# EAGLE design adapter_board (EAGLE 9.6.2)

## Sheet 1 of 2: Connectors
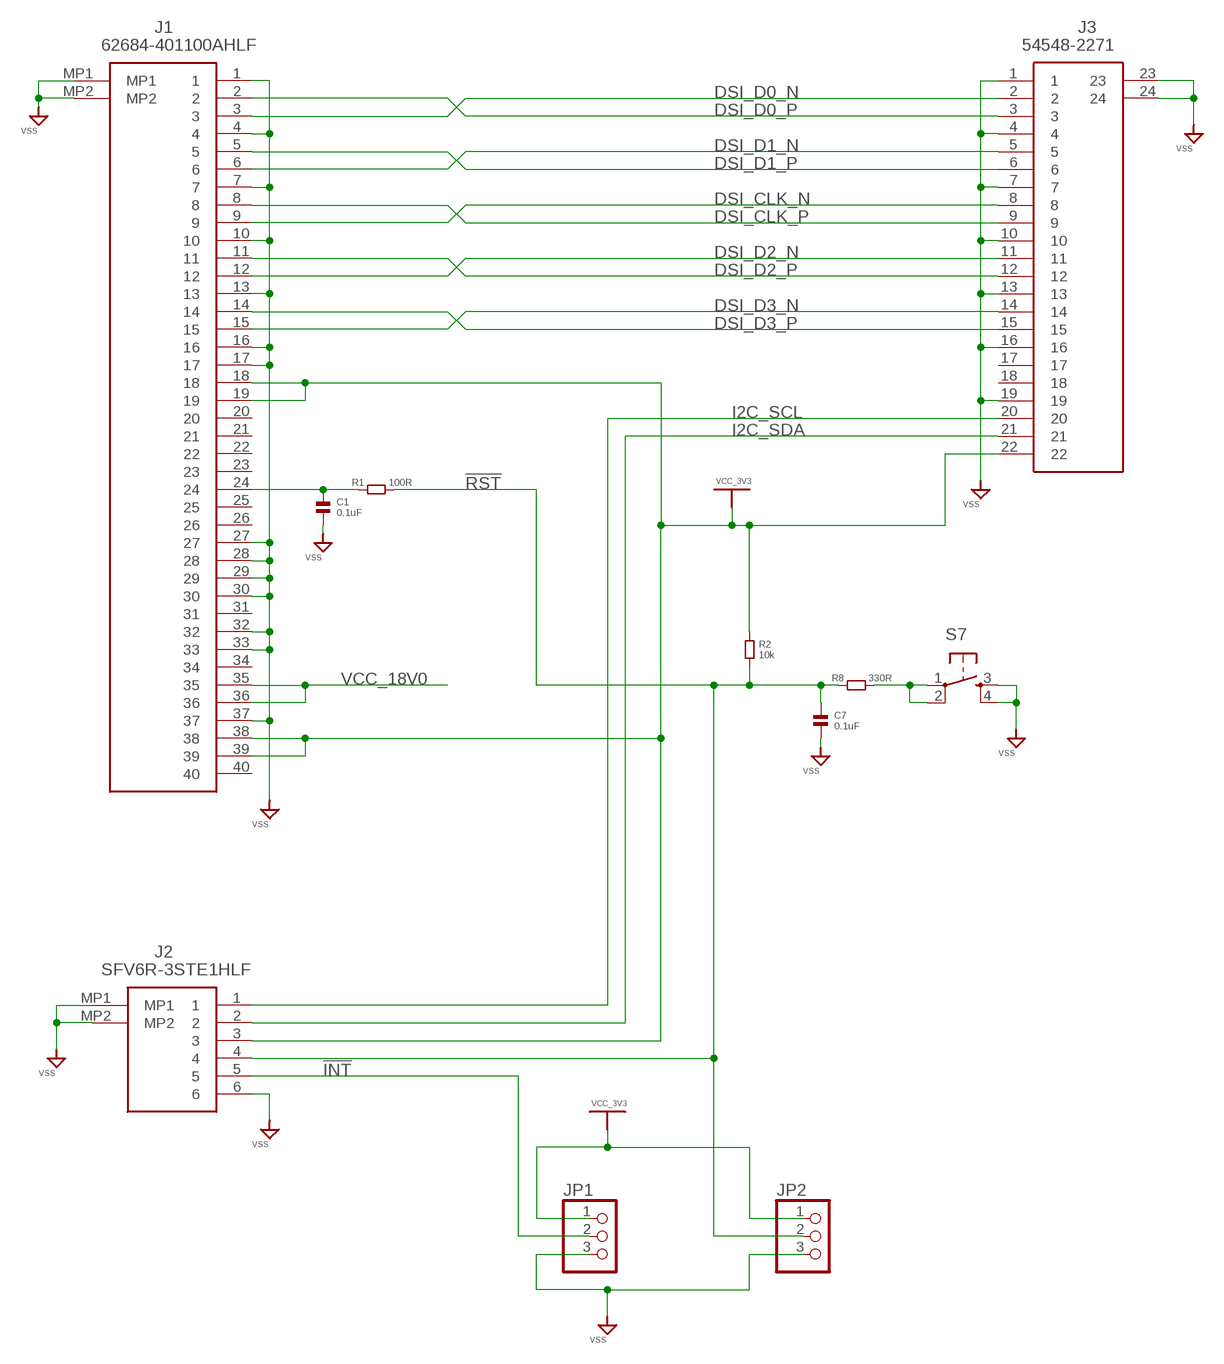
[diagram p0: schematic, sheet 1]

### Parts
C1  0.1uF  CAPACITOR.0603  [0603]
C7  0.1uF  CAPACITOR.0603  [0603]
J1  62684-401100AHLF  [62684401100AHLF]
J2  SFV6R-3STE1HLF  [SFV6R3STE1HLF]
J3  54548-2271  [545482271]
JP1  PINHD-1X3  [1X03]
JP2  PINHD-1X3  [1X03]
R1  100R  RESISTOR.0603  [0603]
R2  10k  RESISTOR.0603  [0603]
R8  330R  RESISTOR.0603  [0603]
S7  TAC_SWITCHPTH  [TACTILE-PTH]

### Nets
!INT: J2.5 JP1.2
!RST: C7.1 J2.4 JP2.2 R1.2 R2.2 R8.1
DSI_CLK_N [DSI]: J1.9 J3.8
DSI_CLK_P [DSI]: J1.8 J3.9
DSI_D0_N [DSI]: J1.3 J3.2
DSI_D0_P [DSI]: J1.2 J3.3
DSI_D1_N [DSI]: J1.6 J3.5
DSI_D1_P [DSI]: J1.5 J3.6
DSI_D2_N [DSI]: J1.12 J3.11
DSI_D2_P [DSI]: J1.11 J3.12
DSI_D3_N [DSI]: J1.15 J3.14
DSI_D3_P [DSI]: J1.14 J3.15
I2C_SCL: J2.1 J3.20
I2C_SDA: J2.2 J3.21
N$1: C1.1 J1.24 R1.1
N$5: R8.2 S7.1 S7.2
VCC_3V3: J1.18 J1.19 J1.38 J1.39 J2.3 J3.22 JP1.1 JP2.1 R2.1
VCC_18V0: J1.35 J1.36 ; also sheet 2
VSS: C1.2 C7.2 J1.1 J1.4 J1.7 J1.10 J1.13 J1.16 J1.17 J1.27 J1.28 J1.29 J1.30 J1.32 J1.33 J1.37 J1.MP1 J1.MP2 J2.6 J2.MP1 J2.MP2 J3.1 J3.4 J3.7 J3.10 J3.13 J3.16 J3.19 J3.23 J3.24 JP1.3 JP2.3 S7.3 S7.4 ; also sheet 2
Unconnected: J1.20 J1.21 J1.22 J1.23 J1.25 J1.26 J1.31 J1.34 J1.40 J3.17 J3.18

## Sheet 2 of 2: Backlight Boost Converter
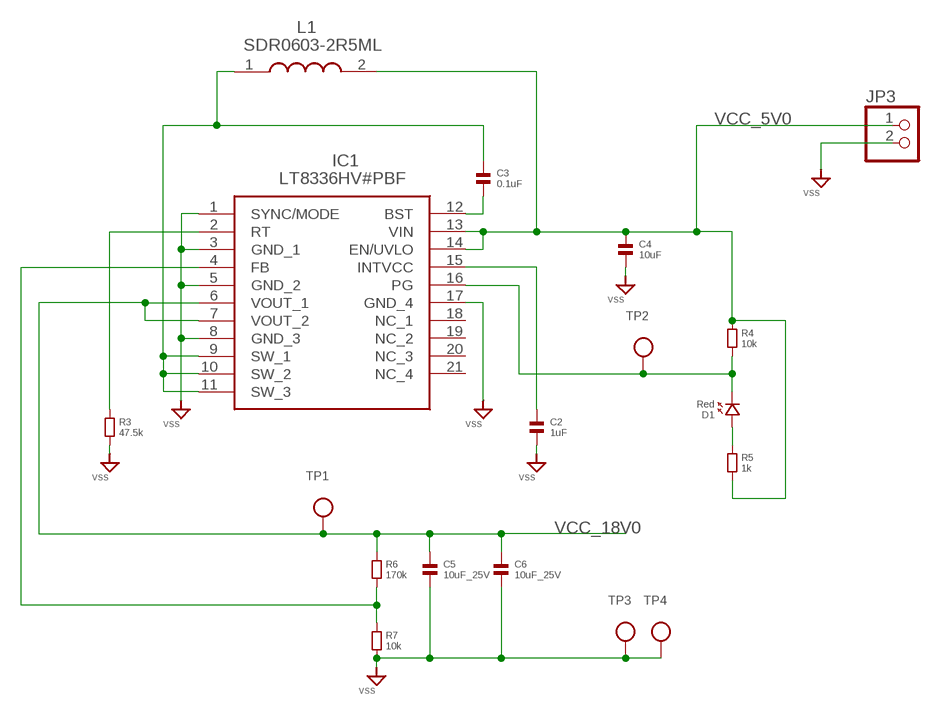
[diagram p1: schematic, sheet 2]

### Parts
C2  1uF  CAPACITOR.0603  [0603]
C3  0.1uF  CAPACITOR.0603  [0603]
C4  10uF  CAPACITOR.0603  [0603]
C5  10uF_25V  CAPACITOR.0805  [0805]
C6  10uF_25V  CAPACITOR.0805  [0805]
D1  Red  LED.0603  [0603.LED]
IC1  LT8336HV#PBF  [LT8336HVPBF]
JP3  PINHD-1X2  [1X02]
L1  SDR0603-2R5ML  [SDR06032R5ML]
R3  47.5k  RESISTOR.0603  [0603]
R4  10k  RESISTOR.0603  [0603]
R5  1k  RESISTOR.0603  [0603]
R6  170k  RESISTOR.0603  [0603]
R7  10k  RESISTOR.0603  [0603]
TP1  TESTPOINTROUND1MM  [TESTPOINT_ROUND_1MM]
TP2  TESTPOINTROUND1MM  [TESTPOINT_ROUND_1MM]
TP3  TESTPOINTROUND1MM  [TESTPOINT_ROUND_1MM]
TP4  TESTPOINTROUND1MM  [TESTPOINT_ROUND_1MM]

### Nets
N$2: C2.1 IC1.15(INTVCC)
N$3: IC1.2(RT) R3.1
N$4: C3.1 IC1.9(SW_1) IC1.10(SW_2) IC1.11(SW_3) L1.1
N$7: C3.2 IC1.12(BST)
N$8: D1.P$2 IC1.16(PG) R4.2 TP2.P$1
N$9: D1.P$1 R5.1
N$12: IC1.4(FB) R6.2 R7.1
VCC_5V0: C4.1 IC1.13(VIN) IC1.14(EN/UVLO) JP3.1 L1.2 R4.1 R5.2
VCC_18V0: C5.1 C6.1 IC1.6(VOUT_1) IC1.7(VOUT_2) R6.1 TP1.P$1 ; also sheet 1
VSS: C2.2 C4.2 C5.2 C6.2 IC1.1(SYNC/MODE) IC1.3(GND_1) IC1.5(GND_2) IC1.8(GND_3) IC1.17(GND_4) JP3.2 R3.2 R7.2 TP3.P$1 TP4.P$1 ; also sheet 1
Unconnected: IC1.18(NC_1) IC1.19(NC_2) IC1.20(NC_3) IC1.21(NC_4)

## Library data of the parts
C1-C7 = standardparts:CAPACITOR
D1 = standardparts:LED
IC1 = SamacSys_Parts:LT8336HV#PBF: Switching Voltage Regulators 40V, 2.5A Low IQ Sync Step-Up Silent Sw Source: Datasheet <https://www.arrow.com/en/products/lt8336hvpbf/analog-devices>; DESCRIPTION: Switching Voltage Regulators 40V, 2.5A Low IQ Sync Step-Up Silent Sw; HEIGHT: 1.03mm; MANUFACTURER_NAME: Analog Devices; MANUFACTURER_PART_NUMBER: LT8336HV#PBF; MOUSER_PART_NUMBER: 584-LT8336HV#PBF; MOUSER_PRICE-STOCK: https://www.mouser.co.uk/ProductDetail/Analog-Devices/LT8336HVPBF?qs=bAKSY%2FctAC6ZfL1l2LeQJQ%3D%3D
J1 = SamacSys_Parts:62684-401100AHLF: FFC & FPC Connectors 62684-401100AHLF-OPUD Source: Datasheet <https://www.mouser.co.uk/datasheet/2/18/62684-1363141.pdf>; DESCRIPTION: FFC & FPC Connectors 62684-401100AHLF-OPUD; HEIGHT: 2.3mm; MANUFACTURER_NAME: Amphenol; MANUFACTURER_PART_NUMBER: 62684-401100AHLF; MOUSER_PART_NUMBER: 649-62684-401100AHLF; MOUSER_PRICE-STOCK: https://www.mouser.co.uk/ProductDetail/Amphenol-FCI/62684-401100AHLF?qs=6gcroF09reXdRG%252BmgzzG%2FQ%3D%3D
J2 = SamacSys_Parts:SFV6R-3STE1HLF: FFC & FPC Connectors 6P R/A SMT FFC/FPC 0.5mm CONT SPACING Source: Datasheet; DESCRIPTION: FFC & FPC Connectors 6P R/A SMT FFC/FPC 0.5mm CONT SPACING; HEIGHT: 2mm; MANUFACTURER_NAME: Amphenol; MANUFACTURER_PART_NUMBER: SFV6R-3STE1HLF; MOUSER_PART_NUMBER: 649-SFV6R-3STE1HLF; MOUSER_PRICE-STOCK: https://www.mouser.co.uk/ProductDetail/Amphenol-FCI/SFV6R-3STE1HLF?qs=pLQRQR43dtql2xROP1LV5w%3D%3D
J3 = SamacSys_Parts:54548-2271: FFC & FPC Connectors 0.5 FPC ZIF Hsg Assy ssy 22Ckt EmbsTp Pkg Source: Datasheet <http://www.molex.com/webdocs/datasheets/pdf/en-us//0545482271_FFC_FPC_CONNECTORS.pdf>; DESCRIPTION: FFC & FPC Connectors 0.5 FPC ZIF Hsg Assy ssy 22Ckt EmbsTp Pkg; HEIGHT: 1mm; MANUFACTURER_NAME: Molex; MANUFACTURER_PART_NUMBER: 54548-2271; MOUSER_PART_NUMBER: 538-54548-2271; MOUSER_PRICE-STOCK: https://www.mouser.co.uk/ProductDetail/Molex/54548-2271?qs=qM7ngqbhX5X3ZiWzRWv9wA%3D%3D
JP1 JP2 = pinhead:PINHD-1X3: PIN HEADER
JP3 = pinhead:PINHD-1X2: PIN HEADER
L1 = SamacSys_Parts:SDR0603-2R5ML: Fixed Inductors 2.5uH 20% SMD 0603 Source: Datasheet <https://datasheet.datasheetarchive.com/originals/distributors/Datasheets-7/DSA-121824.pdf>; DESCRIPTION: Fixed Inductors 2.5uH 20% SMD 0603; HEIGHT: 3.9mm; MANUFACTURER_NAME: Bourns; MANUFACTURER_PART_NUMBER: SDR0603-2R5ML; MOUSER_PART_NUMBER: 652-SDR0603-2R5ML; MOUSER_PRICE-STOCK: https://www.mouser.co.uk/ProductDetail/Bourns/SDR0603-2R5ML?qs=xrpI9KL%2FXvtC70ZWV5ML9w%3D%3D
R1-R8 = standardparts:RESISTOR
S7 = SparkFun:TAC_SWITCH: Momentary Switch Button commonly used for reset or general input. Spark Fun Electronics SKU : COM-00097
TP1-TP4 = microbuilder:TESTPOINT: Test Point Various test points for characterisation and PCB testing TESTPOINT_SMT - Compact Surface Mount Test Point [Digikey: 5016KTR-ND]

## Net classes
1 DSI: width 0.127 mm, clearance 0.152 mm

## Board
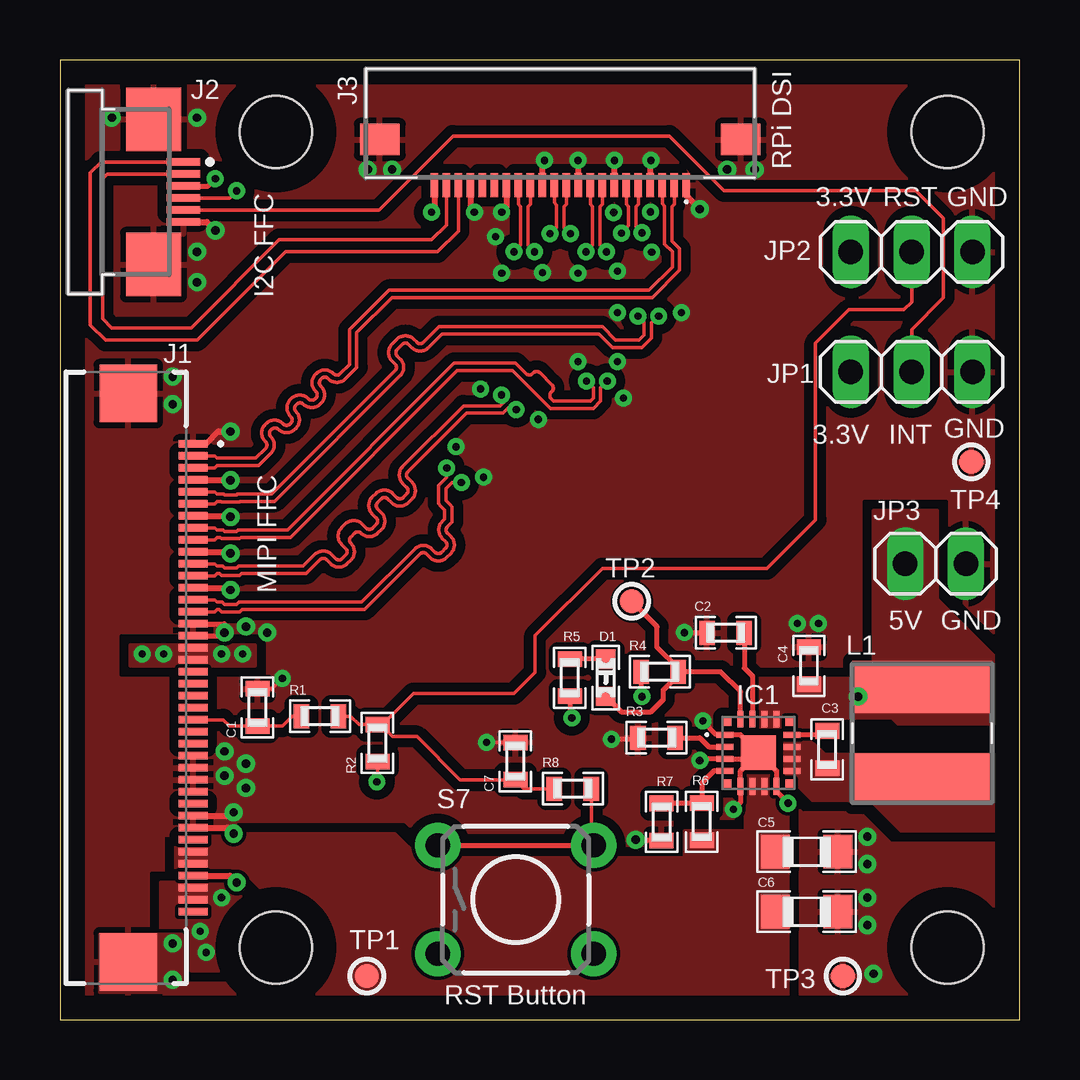
[diagram p2: board, top side]
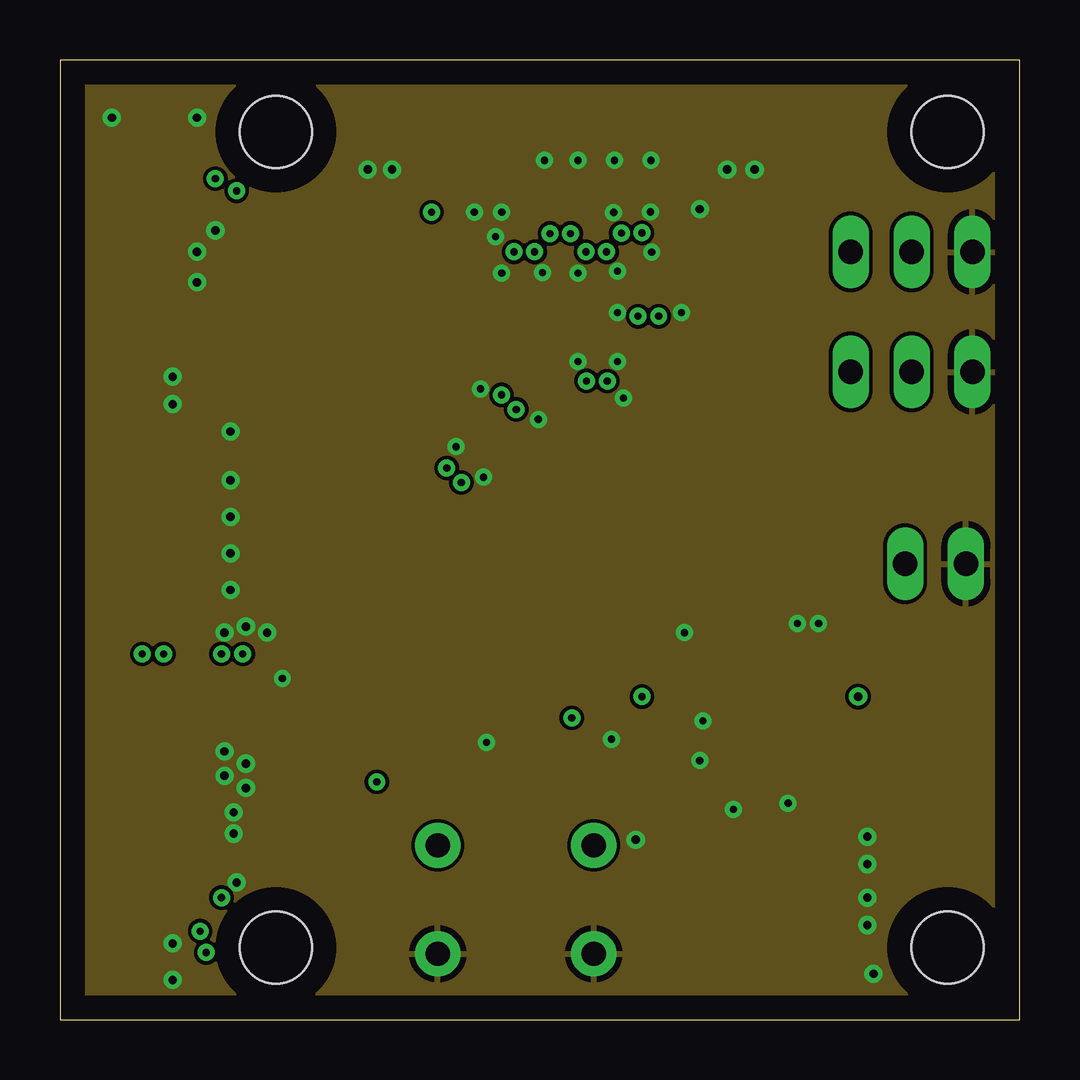
[diagram p3: board, inner layer Route2]
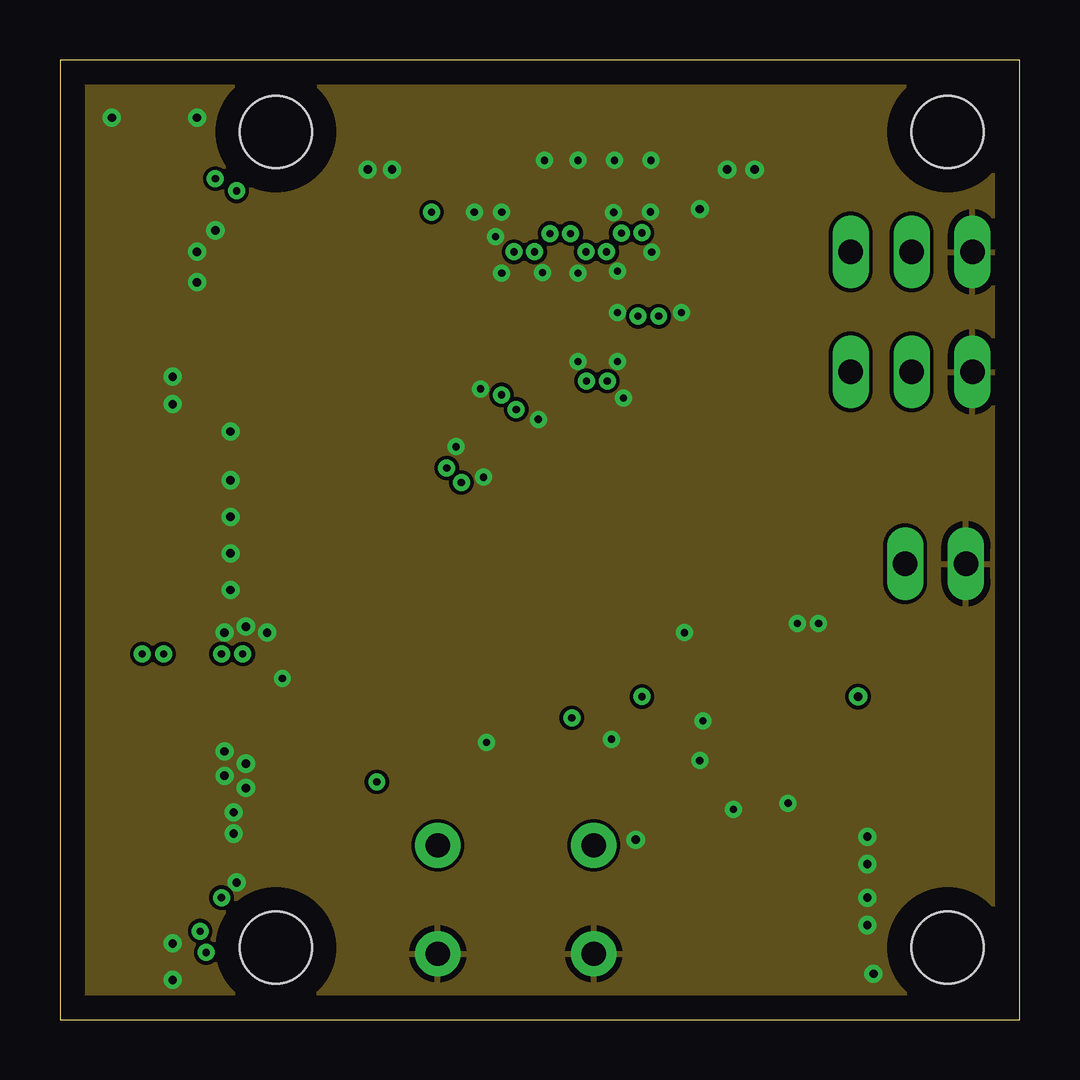
[diagram p4: board, inner layer Route15]
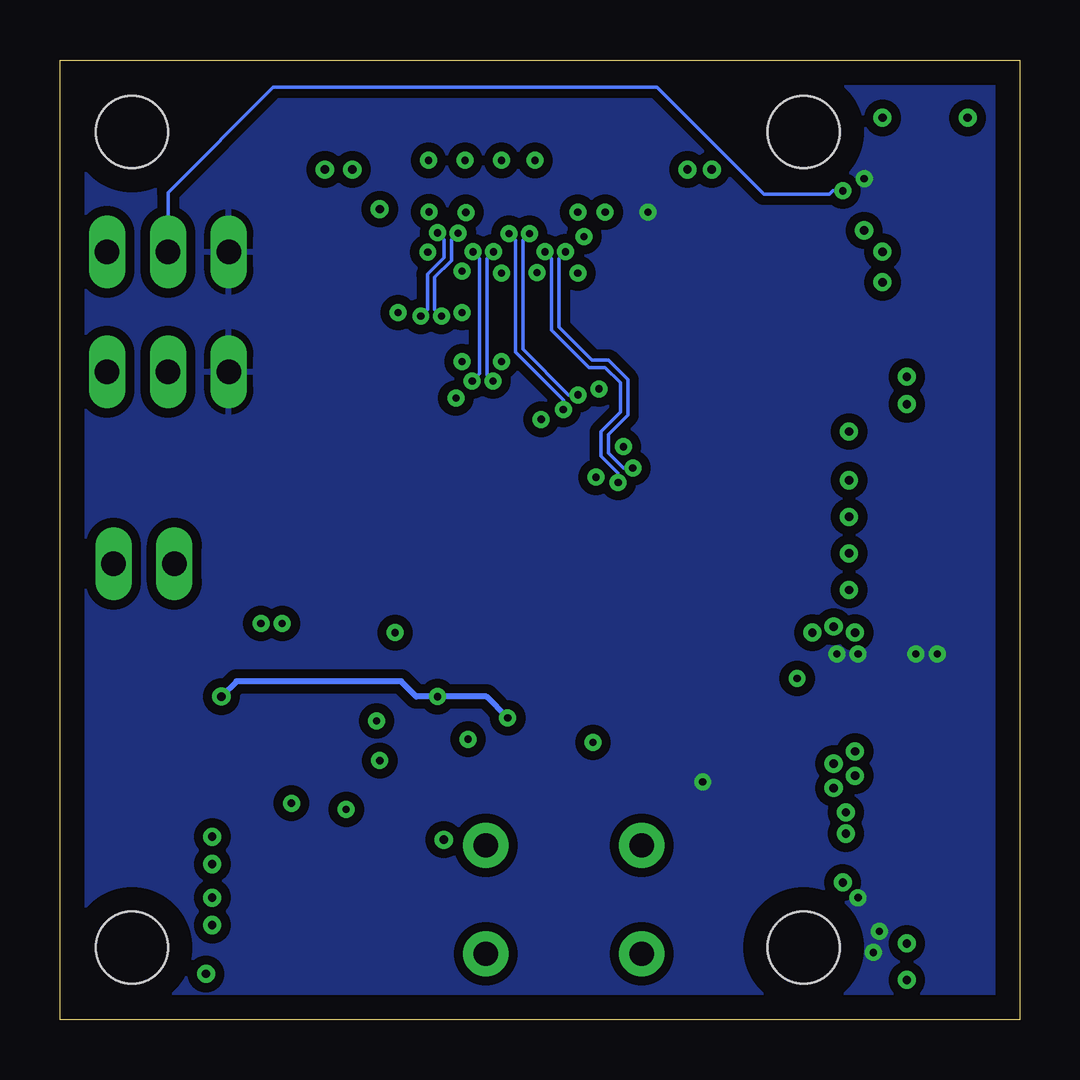
[diagram p5: board, bottom side, seen from below]

Size 40 x 40 mm. Coordinates in mm from the lower left corner, seen from the top.
Outline: 0,0 40,0 40,40 0,40 0,0
Copper layers (1+2*15+16): Top 0.035mm / dielectric 0.1mm / Route2 0.035mm / dielectric 1.26mm / Route15 0.035mm / dielectric 0.1mm / Bottom 0.035mm
Design rules "default *": minimum track width 6mil, minimum drill 0.3mm, track to track 6mil, track to pad 6mil, pad to pad 6mil, via to via 6mil, smd to smd 0mil, copper to edge 40mil, drill to drill 6mil, minimum pad ring 10mil, minimum via ring 8mil, stop-mask expansion 4mil, vias tented up to drill 0mil, thermal gap 10mil
Holes 3 mm at 9,37 9,3 37,3 37,37

### Footprints (pad centres in the part's own frame; a part is rotated, then mirrored left to right if it is on the bottom)
0603 = smd 0.65 x 1: 1 -0.775,0; 2 0.775,0
0805 = smd 1.2 x 1.4: 1 -1.3,0; 2 1.3,0
0603.LED = smd 0.8 x 0.8: P$1 -0.775,0; P$2 0.775,0
LT8336HVPBF = smd 0.25 x 0.7: 1 -0.75,-1.4; 2 -0.25,-1.4; 3 0.25,-1.4; 4 0.75,-1.4; 9 0.75,1.4; 10 0.25,1.4; 11 -0.25,1.4; 12 -0.75,1.4 | smd 0.7 x 0.25: 5 1.4,-0.75; 6 1.4,-0.25; 7 1.4,0.25; 8 1.4,0.75; 13 -1.4,0.75; 14 -1.4,0.25; 15 -1.4,-0.25; 16 -1.4,-0.75 | smd 1.44 x 1.44: 17 0,0 | smd 0.375 x 0.375: 18 -1.312,-1.313; 19 1.312,-1.313; 20 1.312,1.312; 21 -1.312,1.312
62684401100AHLF = smd 0.3 x 1.2: 1 -9.75,2.8; 2 -9.25,2.8; 3 -8.75,2.8; 4 -8.25,2.8; 5 -7.75,2.8; 6 -7.25,2.8; 7 -6.75,2.8; 8 -6.25,2.8; 9 -5.75,2.8; 10 -5.25,2.8; 11 -4.75,2.8; 12 -4.25,2.8; 13 -3.75,2.8; 14 -3.25,2.8; 15 -2.75,2.8; 16 -2.25,2.8; 17 -1.75,2.8; 18 -1.25,2.8; 19 -0.75,2.8; 20 -0.25,2.8; 21 0.25,2.8; 22 0.75,2.8; 23 1.25,2.8; 24 1.75,2.8; 25 2.25,2.8; 26 2.75,2.8; 27 3.25,2.8; 28 3.75,2.8; 29 4.25,2.8; 30 4.75,2.8; 31 5.25,2.8; 32 5.75,2.8; 33 6.25,2.8; 34 6.75,2.8; 35 7.25,2.8; 36 7.75,2.8; 37 8.25,2.8; 38 8.75,2.8; 39 9.25,2.8; 40 9.75,2.8 | smd 2.4 x 2.4: MP1 -11.85,0.1; MP2 11.85,0.1
SFV6R3STE1HLF = smd 0.3 x 1.4: 1 -1.25,2.4; 2 -0.75,2.4; 3 -0.25,2.4; 4 0.25,2.4; 5 0.75,2.4; 6 1.25,2.4 | smd 2.65 x 2.3: MP1 -3.025,1.15; MP2 3.025,1.15
545482271 = smd 0.3 x 1: 1 -5.25,2.05; 2 -4.75,2.05; 3 -4.25,2.05; 4 -3.75,2.05; 5 -3.25,2.05; 6 -2.75,2.05; 7 -2.25,2.05; 8 -1.75,2.05; 9 -1.25,2.05; 10 -0.75,2.05; 11 -0.25,2.05; 12 0.25,2.05; 13 0.75,2.05; 14 1.25,2.05; 15 1.75,2.05; 16 2.25,2.05; 17 2.75,2.05; 18 3.25,2.05; 19 3.75,2.05; 20 4.25,2.05; 21 4.75,2.05; 22 5.25,2.05 | smd 1.65 x 1.3: 23 -7.525,0.15; 24 7.525,0.15
1X03 = drill 1.016 long: 1 -2.54,0; 2 0,0; 3 2.54,0
1X02 = drill 1.016 long: 1 -1.27,0; 2 1.27,0
SDR06032R5ML = smd 5.8 x 2.15: 1 0,-1.925; 2 0,1.925
TACTILE-PTH = drill 1.016 pad 1.88: 1 -3.251,2.261; 2 3.251,2.261; 3 -3.251,-2.261; 4 3.251,-2.261
TESTPOINT_ROUND_1MM = smd 1 x 1: P$1 0,0

### Placement (x,y rotation side)
C1  8.23,13.01 90 top
C2  27.75,16.12 180 top
C3  31.98,11.26 90 top
C4  31.22,14.75 90 top
C5  31.12,7 0 top
C6  31.12,4.5 0 top
C7  18.98,10.77 90 top
D1  22.75,14.25 270 top
IC1  29.11,11.12 270 top
J1  2.75,14.25 270 top
J2  2.75,34.5 270 top
J3  20.86,36.83 180 top
JP1  35.5,27 0 top
JP2  35.5,32 0 top
JP3  36.5,19 0 top
L1  35.94,11.94 0 top
R1  10.84,12.64 0 top
R2  13.23,11.53 90 top
R3  24.87,11.75 180 top
R4  25,14.5 0 top
R5  21.25,14.25 270 top
R6  26.75,8.25 90 top
R7  25.08,8.23 270 top
R8  21.38,9.62 0 top
S7  19,5 0 top
TP1  12.79,1.81 0 top
TP2  23.84,17.43 0 top
TP3  32.63,1.81 0 top
TP4  37.99,23.25 0 top

### Tracks (layer width: path | path; a pad name or v marks a point on that pad's centre or on a via)
!INT
  Top 0.152: JP1.2 35.5,28.77 36.83,30.1 36.83,33.4 35.69,34.54 27.69,34.54 25.4,36.83 16.38,36.83 13.3,33.75 J2.5
!RST  (via drill 0.3)
  Top 0.152: R1.2 12.12,12.64 12.47,12.3 R2.2 | R2.2 13.36,12.3 13.87,11.79 14.88,11.79 16.68,9.99 C7.1 19.35,9.62 R8.1 | J2.4 7.07,34.25 v7.37,34.54 | R2.2 13.44,12.3 14.73,13.59 18.92,13.59 19.81,14.48 19.81,16 22.61,18.8 29.46,18.8 31.5,20.83 31.5,28.19 32.89,29.59 35.18,29.59 35.5,29.91 JP2.2
  Bottom 0.152: v7.37,34.54 7.79,34.54 7.93,34.41 10.66,34.41 15.11,38.86 31.11,38.86 35.5,34.48 JP2.2
DSI_CLK_N  (via drill 0.3)
  Top 0.152: J1.9 6.46,20 6.55,20.1 6.68,20.1 6.73,20.04 7.49,20.04 7.54,20.1 9.61,20.1 16.56,27.05 18.87,27.05 20.45,25.48 22.23,25.48 22.54,25.78 22.54,26.34 v22.81,26.61 | J3.8 22.61,33.99 22.5,33.88 22.5,33.4 22.51,33.39 22.51,32.28 v22.79,32
  Bottom 0.152: v22.79,32 22.51,31.73 22.51,26.92 v22.81,26.61
DSI_CLK_P  (via drill 0.3)
  Top 0.152: J1.8 6.46,20.5 6.55,20.4 6.81,20.4 6.86,20.35 7.36,20.35 7.42,20.4 9.48,20.4 16.43,27.36 19,27.36 19.43,26.92 arc90 19.7,26.92 19.73,26.96 arc-90 20,26.96 20.51,26.45 arc-90 20.51,26.18 20.48,26.15 arc90 20.48,25.88 20.57,25.78 22.11,25.78 22.23,25.91 22.23,26.34 v21.95,26.62 | J3.9 22.11,33.98 22.2,33.89 22.2,33.28 22.2,33.27 22.2,32.28 v21.93,32
  Bottom 0.152: v21.93,32 22.2,31.73 22.2,26.87 v21.95,26.62
DSI_D0_N
  Top 0.152: J1.3 6.46,23 6.55,23.1 8.29,23.1 8.79,23.6 arc90 8.79,24.3 arc-90 8.79,24.57 8.83,24.61 arc-90 9.1,24.61 arc90 9.8,24.61 9.84,24.64 arc90 9.84,25.35 arc-90 9.84,25.61 9.88,25.66 arc-90 10.14,25.66 arc90 10.85,25.66 10.88,25.69 arc90 10.88,26.39 10.87,26.41 arc-90 10.87,26.68 10.91,26.72 arc-90 11.18,26.72 11.19,26.7 arc90 11.89,26.7 12.37,27.18 12.37,28.63 13.84,30.1 24.69,30.1 25.83,31.24 25.83,32.13 25.51,32.45 25.51,33.88 25.61,33.98 J3.2
DSI_D0_P
  Top 0.152: J1.2 6.46,23.5 6.55,23.4 8.16,23.4 8.57,23.81 arc90 8.57,24.08 8.55,24.1 arc-90 8.55,24.8 8.59,24.84 arc-90 9.29,24.84 9.31,24.82 arc90 9.58,24.82 9.62,24.86 arc90 9.62,25.13 9.6,25.15 arc-90 9.6,25.85 9.64,25.89 arc-90 10.34,25.89 10.36,25.87 arc90 10.63,25.87 10.67,25.91 arc90 10.67,26.18 10.65,26.2 arc-90 10.65,26.9 10.69,26.94 arc-90 11.39,26.94 11.41,26.92 arc90 11.68,26.92 12.06,27.3 12.06,28.75 13.72,30.4 24.56,30.4 25.53,31.37 25.53,32 25.2,32.33 25.2,33.88 25.2,33.91 25.11,34 J3.3
DSI_D1_N  (via drill 0.3)
  Top 0.152: J1.6 6.46,21.5 6.55,21.6 6.7,21.6 6.73,21.57 7.49,21.57 7.52,21.6 8.95,21.6 14.19,26.84 arc90 14.19,27.54 14.06,27.67 arc-90 14.06,27.93 14.26,28.14 arc-90 14.53,28.14 14.66,28.01 arc90 15.36,28.01 15.93,28.57 22.48,28.57 23.04,28.02 24.26,28.02 24.65,28.41 24.65,29.05 24.92,29.32 v24.96,29.32 | J3.5 24.11,33.98 24.01,33.88 24.01,33.04 v24.26,32.79
  Bottom 0.152: v24.26,32.79 23.98,32.52 23.98,31.77 24.68,31.07 24.68,29.59 v24.96,29.32
DSI_D1_P  (via drill 0.3)
  Top 0.152: J1.5 6.46,22 6.55,21.9 6.83,21.9 6.86,21.87 7.36,21.87 7.39,21.9 8.82,21.9 13.97,27.05 arc90 13.97,27.32 13.84,27.45 arc-90 13.84,28.15 14.05,28.36 arc-90 14.75,28.36 14.88,28.23 arc90 15.15,28.23 15.8,28.88 22.61,28.88 23.16,28.32 24.13,28.32 24.34,28.53 24.34,29.08 v24.1,29.32 | J3.6 23.61,33.98 23.7,33.88 23.7,33.09 v23.4,32.79
  Bottom 0.152: v23.4,32.79 23.68,32.51 23.68,31.64 24.38,30.95 24.38,29.59 v24.1,29.32
DSI_D2_N  (via drill 0.3)
  Top 0.152: J3.11 21.11,33.98 21.01,33.88 21.01,33.02 21.26,32.77 v21.29,32.77 | J1.12 6.46,18.5 6.55,18.6 6.66,18.6 6.73,18.52 7.49,18.52 7.57,18.6 10.27,18.6 10.84,19.17 arc-90 11.11,19.17 11.28,19 arc90 11.98,19 12.13,19.15 arc90 12.13,19.85 arc-90 12.13,20.12 12.28,20.27 arc-90 12.55,20.27 arc90 13.25,20.27 13.4,20.42 arc90 13.4,21.12 13.24,21.28 arc-90 13.24,21.55 13.39,21.7 arc-90 13.66,21.7 13.82,21.55 arc90 14.52,21.55 14.67,21.7 arc90 14.67,22.4 14.5,22.57 arc-90 14.5,22.84 16.94,25.27 18.46,25.27 18.76,25.57 18.89,25.57 v19.02,25.43
  Bottom 0.152: v21.29,32.77 21.01,32.49 21.01,31.36 21.01,30.87 21.01,29.34 21.01,29.33 21.01,27.81 19.02,25.82 v19.02,25.43
DSI_D2_P  (via drill 0.3)
  Top 0.152: J3.12 20.61,34.04 20.7,33.95 20.7,33.02 20.45,32.77 v20.43,32.77 | J1.11 6.46,19 6.55,18.9 6.78,18.9 6.86,18.82 7.36,18.82 7.44,18.9 10.14,18.9 10.62,19.39 arc-90 11.32,19.39 11.49,19.22 arc90 11.76,19.22 11.91,19.37 arc90 11.91,19.64 11.74,19.81 arc-90 11.74,20.51 11.89,20.66 arc-90 12.6,20.66 12.77,20.49 arc90 13.03,20.49 13.19,20.64 arc90 13.19,20.91 13.02,21.08 arc-90 13.02,21.78 13.17,21.93 arc-90 13.87,21.93 14.04,21.76 arc90 14.31,21.76 14.46,21.91 arc90 14.46,22.18 14.29,22.35 arc-90 14.29,23.05 16.82,25.58 18.34,25.58 18.54,25.78 18.54,25.91 v18.41,26.04
  Bottom 0.152: v20.43,32.77 20.7,32.49 20.7,31.48 20.7,30.75 20.7,29.46 20.7,27.94 18.8,26.04 v18.41,26.04
DSI_D3_N  (via drill 0.3)
  Top 0.152: J3.14 19.61,33.98 19.51,33.88 19.51,32.28 v19.79,32 | J1.15 6.46,17 6.55,17.1 6.63,17.1 6.73,17 7.49,17 7.59,17.1 12.7,17.1 15.01,19.41 arc-90 15.28,19.41 15.42,19.26 arc90 16.12,19.26 16.29,19.43 arc90 16.29,20.13 16.15,20.28 arc-90 16.15,20.55 16.26,20.65 | v16.73,22.39 16.34,22.39 16.09,22.14 16.09,21.63 16.26,21.46 | 16.26,21.46 | 16.26,21.46 16.34,21.37 16.34,20.74 16.26,20.65 | 16.26,20.65
  Bottom 0.152: v16.73,22.39 16.73,22.78 17.36,23.41 | 17.36,23.41 | 17.36,23.41 17.45,23.5 17.45,24.51 17.36,24.6 | 17.36,24.6 | 17.36,24.6 16.64,25.32 16.64,26.54 17.27,27.18 17.96,27.18 19.51,28.73 19.51,31.73 v19.79,32
DSI_D3_P  (via drill 0.3)
  Top 0.152: J3.15 19.11,33.98 19.2,33.88 19.2,32.28 v18.93,32 | J1.14 6.46,17.5 6.55,17.4 6.76,17.4 6.86,17.3 7.36,17.3 7.47,17.4 12.58,17.4 14.8,19.62 arc-90 15.5,19.62 15.64,19.48 arc90 15.91,19.48 16.08,19.65 arc90 16.08,19.92 15.94,20.06 arc-90 15.94,20.76 16.04,20.87 16.04,21.25 15.88,21.41 | v16.12,22.99 16.12,22.6 15.79,22.26 15.79,21.5 15.88,21.41 | 15.88,21.41
  Bottom 0.152: v16.12,22.99 16.52,22.99 17.14,23.62 17.14,24.38 16.33,25.2 16.33,26.67 17.15,27.48 17.83,27.48 19.2,28.86 19.2,31.73 v18.93,32
I2C_SCL
  Top 0.152: J2.1 1.71,35.75 1.27,35.31 1.27,28.96 1.91,28.32 5.71,28.32 9.4,32 15.75,32 16.61,32.86 J3.20
I2C_SDA
  Top 0.152: J3.21 16.11,33.12 15.49,32.51 9.14,32.51 5.46,28.83 2.16,28.83 1.78,29.21 1.78,35.05 1.98,35.25 J2.2
N$1
  Top 0.152: J1.24 6.8,12.5 7.07,12.23 C1.1 9.27,12.23 9.68,12.64 R1.1
N$2
  Top 0.203: C2.1 28.52,14.65 28.86,14.31 IC1.15
N$3
  Top 0.203: IC1.2 27.05,11.38 26.68,11.75 R3.1
N$4
  pour Top (rank 2, no thermals): 30.23,11.56 31.37,11.56 31.88,11.05 39.5,11.05 39.5,7.87 35.05,7.87 33.78,9.14 31.37,9.14 30.23,10.29
N$5
  Top 0.152: R8.2 22.15,7.36 S7.2
  Top 0.203: S7.1 S7.2
N$7
  Top 0.203: C3.2 31.83,11.88 IC1.12
N$8
  Top 0.203: IC1.16 28.36,13.67 27.54,14.5 R4.2 | TP2.P$1 24.89,16.38 24.89,15.51 25.77,14.63 R4.2 | D1.P$2 23.4,12.83 24.64,12.83 25.15,13.34 25.15,13.74 25.77,14.37 R4.2
N$9
  Top 0.203: D1.P$1 R5.1
N$12
  Top 0.203: IC1.4 27.27,10.38 26.75,9.86 R6.2 26.73,9.01 R7.1
VCC_3V3  (via drill 0.3)
  Top 0.152: R2.1 13.23,9.93 v13.21,9.91
  Top 0.203: J2.3 6.17,34.75 v6.48,35.05
  Top 0.254: J3.22 15.61,33.77 v15.49,33.66
  other vias: 6.73,5.08 5.84,3.68 6.1,2.79 6.73,15.24 7.62,15.24 4.32,15.24 3.43,15.24
  pour Top (rank 2, no thermals): 4.19,3.81 5.33,3.81 5.46,3.68 5.46,2.03 8.13,2.03 8.13,4.7 7.49,5.33 7.11,5.71 4.19,5.71
  pour Top (no thermals): 2.92,14.73 8.13,14.73 8.13,15.62 2.92,15.62
  pour Bottom (isolate 0.381): 0,0 40.01,0 40.01,40.01 0,40.01
VCC_5V0  (via drill 0.3, 0.35)
  Top 0.203: R4.1 24.23,13.49 v24.26,13.46 | R5.2 21.25,12.66 v21.34,12.57
  Bottom 0.254: v21.34,12.57 22.23,13.46 v24.26,13.46 25.15,13.46 25.78,14.1 32.64,14.1 v33.27,13.46
  pour Top (no thermals): 29.08,12.19 29.08,14.22 33.91,14.22 33.91,21.21 36.58,21.21 36.58,17.53 39.5,14.61 39.5,12.32 34.92,12.32 34.67,12.57 31.88,12.57 31.5,12.19
VCC_18V0
  pour Top (no thermals): 28.57,10.16 28.57,7.87 26.04,7.87 26.04,6.73 14.99,6.73 13.97,7.75 4.83,7.75 4.83,5.97 7.87,5.97 9.02,4.83 9.02,-0.13 30.35,-0.13 30.35,10.16
VSS  (via drill 0.3, 0.35)
  Top 0.152: C7.2 18.97,11.56 v17.78,11.56 | C1.2 8.83,13.79 v9.27,14.22
  Top 0.203: v26.8,12.45 27.37,11.88 IC1.1 28.36,11.88 IC1.17 | v26.67,10.79 26.75,10.88 IC1.3 28.86,10.88 IC1.17 | R7.2 24.04,7.46 v24,7.49 | v28.07,8.76 28.36,9.06 IC1.5 28.36,10.38 IC1.17 | IC1.17 29.86,10.38 IC1.8 29.86,9.51 v30.35,9.02 | C2.2 v26.04,16.12 v26.04,16.13 | R3.2 24.03,11.68 v22.99,11.68 | J1.17 6.86,16 v6.86,16.13 6.86,16.5 J1.16
  Top 0.254: J1.37 7.08,6 v7.37,5.71 | J1.33 6.99,8 v7.24,7.75 | J1.32 7.1,8.5 v7.24,8.64 | J1.13 7.02,18 v7.11,17.91 | J1.10 7.11,19.5 v7.11,19.43 | J1.7 7.07,21 v7.11,20.95 | J1.4 7.09,22.5 v7.11,22.48 | J1.1 6.09,24 6.6,24.51 v7.11,24.51 | J2.6 6.12,33.25 v6.48,32.89 | J3.1 26.11,34.34 v26.67,33.78 | J3.13 20.11,35.73 v20.19,35.81 | J3.10 21.61,35.8 v21.59,35.81 | J3.7 v23.11,35.81 | J3.4 24.61,35.78 v24.64,35.81 | J3.16 18.61,33.85 v18.41,33.66 | J3.19 17.11,33.82 v17.27,33.66
  other vias: 6.86,11.18 6.86,10.16 7.75,10.67 7.75,9.65 7.75,16.38 8.64,16.13 4.7,25.65 4.7,26.8 4.7,3.17 4.7,1.65 5.71,30.73 5.71,32 5.71,37.59 2.16,37.59 12.83,35.43 13.84,35.43 27.81,35.43 28.96,35.43 33.66,3.94 33.66,5.08 33.66,6.48 33.66,7.62 33.91,1.91 17.65,22.61 16.51,23.88 17.53,26.29 19.94,25.02 21.59,27.43 23.24,27.43 25.91,29.46 23.24,29.46 24.67,31.99 23.24,31.2 21.59,31.11 20.12,31.14 18.41,31.11 23.08,33.64 24.62,33.67 18.16,32.64 23.5,25.91 30.73,16.51 31.62,16.51
  pour Top (no thermals): 1.65,3.56 5.08,3.56 5.08,1.14 1.65,1.14
  pour Route2: 0,40.01 40.01,40.01 40.01,0 0,0
  pour Top (isolate 0.381, rank 6): 0,40.01 0,0 40.01,0 40.01,40.01
  pour Route15: 0,40.01 0,0 40.01,0 40.01,39.88 40.01,40.01

### Text on the board
tPlace: RPi DSI | 3.3V | RST | GND | I2C FFC | 3.3V | INT | GND | MIPI FFC | 5V | GND | RST Button